# EAGLE schematic Input (EAGLE 7.1.0)
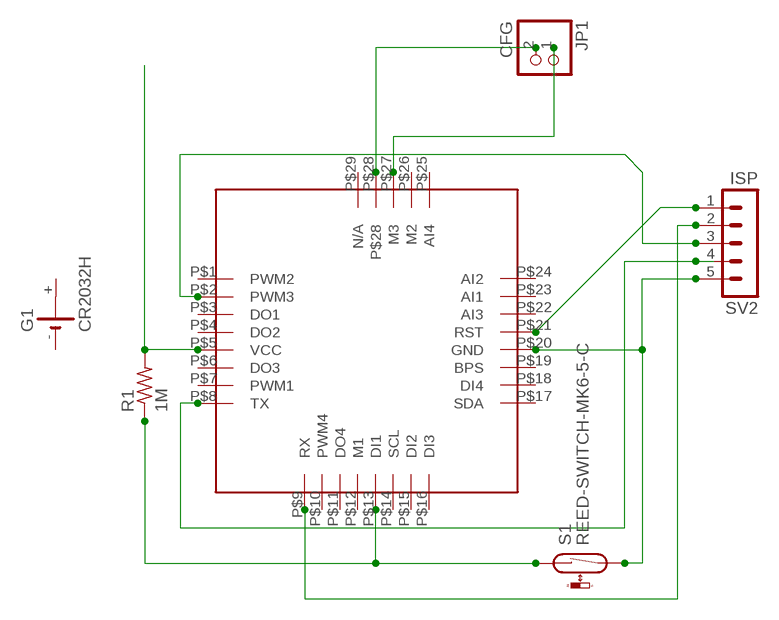
[diagram p0: schematic, sheet 1]

## Parts
G1  CR2032H  [CR2032H]
JP1  CFG  PINHD-1X2  [1X02]
R1  1M  R-US_V234/12  [V234/12]
S1  REED-SWITCH-MK6-5-C  [MK6-5]
SV2  ISP  MA05-1  [MA05-1]
U$1  LITE  [LITE]

## Nets
N$2: SV2.1 U$1.P$21(RST)
N$3: R1.2 U$1.P$5(VCC)
N$4: R1.1 S1.1 U$1.P$13(DI1)
N$5: S1.2 SV2.5 U$1.P$20(GND)
N$6: SV2.2 U$1.P$9(RX)
N$7: SV2.3 U$1.P$2(PWM3)
N$8: SV2.4 U$1.P$8(TX)
N$9: JP1.1 U$1.P$27(M3)
N$10: JP1.2 U$1.P$28
Unconnected: G1.+ G1.+@1(+) G1.- U$1.P$1(PWM2) U$1.P$3(DO1) U$1.P$4(DO2) U$1.P$6(DO3) U$1.P$7(PWM1) U$1.P$10(PWM4) U$1.P$11(DO4) U$1.P$12(M1) U$1.P$14(SCL) U$1.P$15(DI2) U$1.P$16(DI3) U$1.P$17(SDA) U$1.P$18(DI4) U$1.P$19(BPS) U$1.P$22(AI3) U$1.P$23(AI1) U$1.P$24(AI2) U$1.P$25(AI4) U$1.P$26(M2) U$1.P$29(N/A)

## Library data of the parts
G1 = battery:CR2032H: LI BATTERY Varta
JP1 = pinhead:PINHD-1X2: PIN HEADER
R1 = resistor:R-US_: RESISTOR, American symbol
S1 = switch-reed:REED-SWITCH-: Reed Sensor; MF: MEDER; MPN: MK6-5-C; OC_FARNELL: 1079480
SV2 = con-lstb:MA05-1: PIN HEADER; OC_FARNELL: unknown; OC_NEWARK: unknown
U$1 = TWELite:LITE: Zigbee Module by ToCoS